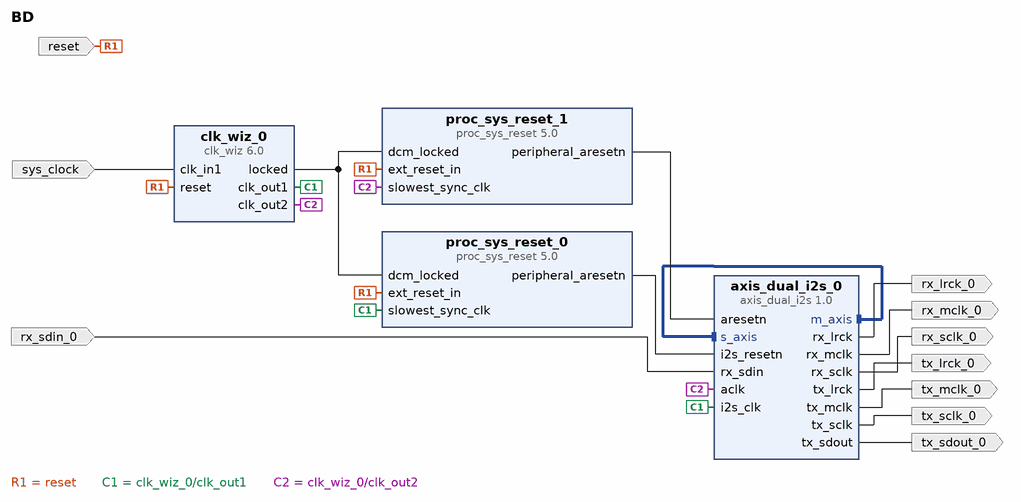
[diagram p0: block diagram of the top level]
# Vivado block design BD, xc7a35tcpg236-1, Vivado 2020.2
create_bd_design BD

create_bd_port -dir I -type clk sys_clock
set_property -dict {CONFIG.FREQ_HZ 100000000 CONFIG.PHASE 0.000} [get_bd_ports sys_clock]
create_bd_port -dir I -type rst reset
set_property -dict {CONFIG.POLARITY ACTIVE_HIGH} [get_bd_ports reset]
create_bd_port -dir I rx_sdin_0
create_bd_port -dir O tx_lrck_0
create_bd_port -dir O rx_sclk_0
create_bd_port -dir O tx_mclk_0
create_bd_port -dir O rx_mclk_0
create_bd_port -dir O tx_sdout_0
create_bd_port -dir O tx_sclk_0
create_bd_port -dir O rx_lrck_0

create_bd_cell -type ip -vlnv xilinx.com:ip:clk_wiz:6.0 clk_wiz_0
set_property -dict [list \
  CONFIG.CLKOUT1_JITTER 201.826 \
  CONFIG.CLKOUT1_PHASE_ERROR 122.577 \
  CONFIG.CLKOUT1_REQUESTED_OUT_FREQ 22.579 \
  CONFIG.CLKOUT2_JITTER 149.337 \
  CONFIG.CLKOUT2_PHASE_ERROR 122.577 \
  CONFIG.CLKOUT2_USED true \
  CONFIG.CLK_IN1_BOARD_INTERFACE sys_clock \
  CONFIG.MMCM_CLKFBOUT_MULT_F 7.000 \
  CONFIG.MMCM_CLKOUT0_DIVIDE_F 31.000 \
  CONFIG.MMCM_CLKOUT1_DIVIDE 7 \
  CONFIG.NUM_OUT_CLKS 2 \
  CONFIG.RESET_BOARD_INTERFACE reset \
  CONFIG.USE_BOARD_FLOW true \
] [get_bd_cells clk_wiz_0]
create_bd_cell -type ip -vlnv xilinx.com:ip:proc_sys_reset:5.0 proc_sys_reset_0
set_property -dict {CONFIG.RESET_BOARD_INTERFACE reset CONFIG.USE_BOARD_FLOW true} [get_bd_cells proc_sys_reset_0]
create_bd_cell -type ip -vlnv xilinx.com:ip:proc_sys_reset:5.0 proc_sys_reset_1
set_property -dict {CONFIG.RESET_BOARD_INTERFACE reset CONFIG.USE_BOARD_FLOW true} [get_bd_cells proc_sys_reset_1]
create_bd_cell -type ip -vlnv DigiLAB:ip:axis_dual_i2s:1.0 axis_dual_i2s_0

# ---- connections ----

connect_bd_intf_net [get_bd_intf_pins axis_dual_i2s_0/m_axis] [get_bd_intf_pins axis_dual_i2s_0/s_axis]
connect_bd_net [get_bd_ports sys_clock] [get_bd_pins clk_wiz_0/clk_in1]
connect_bd_net [get_bd_ports reset] \
  [get_bd_pins clk_wiz_0/reset] [get_bd_pins proc_sys_reset_0/ext_reset_in] [get_bd_pins proc_sys_reset_1/ext_reset_in]
connect_bd_net [get_bd_pins clk_wiz_0/locked] [get_bd_pins proc_sys_reset_0/dcm_locked] [get_bd_pins proc_sys_reset_1/dcm_locked]
connect_bd_net -net rx_sdin_0_1 [get_bd_ports rx_sdin_0] [get_bd_pins axis_dual_i2s_0/rx_sdin]
connect_bd_net [get_bd_pins axis_dual_i2s_0/tx_lrck] [get_bd_ports tx_lrck_0]
connect_bd_net [get_bd_pins axis_dual_i2s_0/rx_sclk] [get_bd_ports rx_sclk_0]
connect_bd_net [get_bd_pins axis_dual_i2s_0/tx_mclk] [get_bd_ports tx_mclk_0]
connect_bd_net [get_bd_pins axis_dual_i2s_0/rx_mclk] [get_bd_ports rx_mclk_0]
connect_bd_net [get_bd_pins axis_dual_i2s_0/tx_sdout] [get_bd_ports tx_sdout_0]
connect_bd_net [get_bd_pins axis_dual_i2s_0/tx_sclk] [get_bd_ports tx_sclk_0]
connect_bd_net [get_bd_pins axis_dual_i2s_0/rx_lrck] [get_bd_ports rx_lrck_0]
connect_bd_net [get_bd_pins clk_wiz_0/clk_out1] [get_bd_pins proc_sys_reset_0/slowest_sync_clk] [get_bd_pins axis_dual_i2s_0/i2s_clk]
connect_bd_net [get_bd_pins clk_wiz_0/clk_out2] [get_bd_pins proc_sys_reset_1/slowest_sync_clk] [get_bd_pins axis_dual_i2s_0/aclk]
connect_bd_net [get_bd_pins proc_sys_reset_1/peripheral_aresetn] [get_bd_pins axis_dual_i2s_0/aresetn]
connect_bd_net [get_bd_pins proc_sys_reset_0/peripheral_aresetn] [get_bd_pins axis_dual_i2s_0/i2s_resetn]

validate_bd_design
save_bd_design
